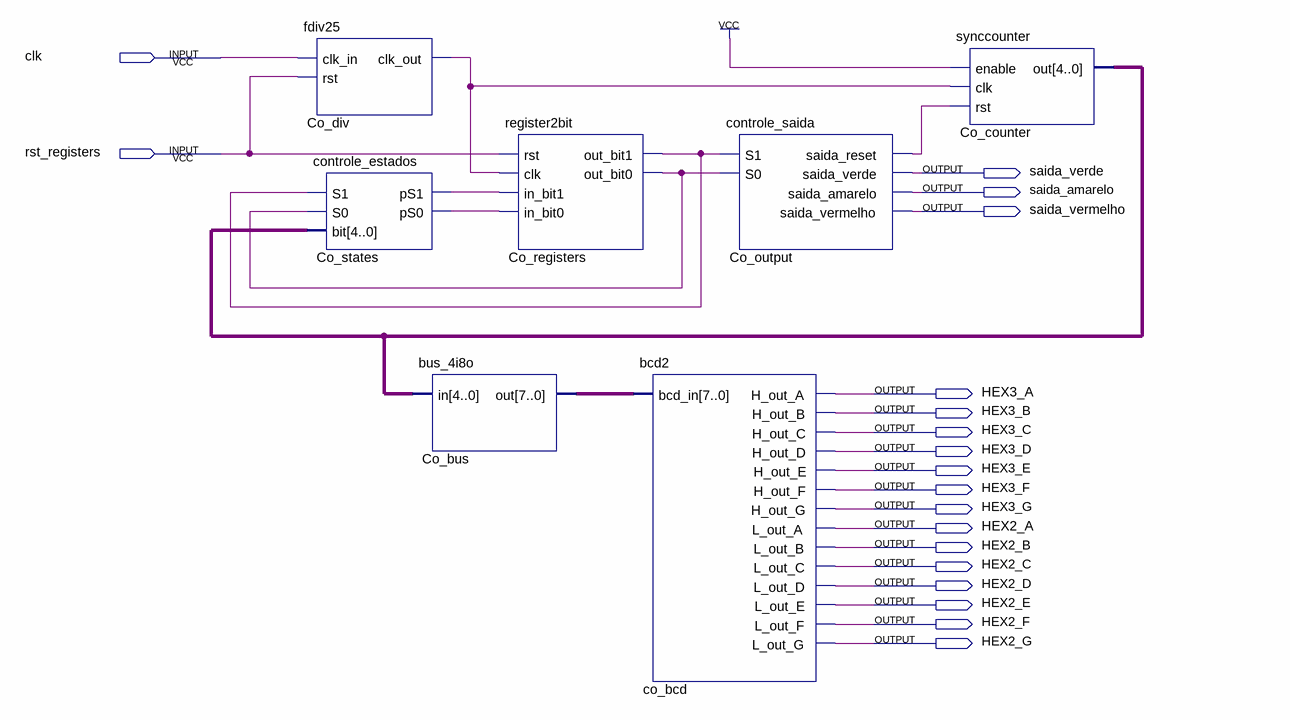
[diagram p0: schematic sheet]
// Quartus schematic lab08.bdf as structural Verilog: 7 symbols, 19 pins
module lab08 (
  input  clk,
  input  rst_registers,
  output saida_verde,
  output saida_amarelo,
  output saida_vermelho,
  output HEX3_A,
  output HEX3_B,
  output HEX3_C,
  output HEX3_D,
  output HEX3_E,
  output HEX3_F,
  output HEX3_G,
  output HEX2_A,
  output HEX2_B,
  output HEX2_C,
  output HEX2_D,
  output HEX2_E,
  output HEX2_F,
  output HEX2_G
);

  wire Co_div_clk_out, Co_output_saida_reset, Co_registers_out_bit0, Co_registers_out_bit1, Co_states_ps0,
       Co_states_ps1;
  wire [4:0] Co_counter_out;
  wire [7:0] Co_bus_out;

  fdiv25 Co_div (.clk_in(clk), .rst(rst_registers), .clk_out(Co_div_clk_out));
  controle_estados Co_states (
    .S1(Co_registers_out_bit1), .S0(Co_registers_out_bit0), .\bit (Co_counter_out), .pS1(Co_states_ps1),
    .pS0(Co_states_ps0));
  bus_4i8o Co_bus (.in(Co_counter_out), .out(Co_bus_out));
  register2bit Co_registers (
    .rst(rst_registers), .clk(Co_div_clk_out), .in_bit1(Co_states_ps1), .in_bit0(Co_states_ps0),
    .out_bit1(Co_registers_out_bit1), .out_bit0(Co_registers_out_bit0));
  bcd2 co_bcd (
    .bcd_in(Co_bus_out), .H_out_A(HEX3_A), .H_out_B(HEX3_B), .H_out_C(HEX3_C), .H_out_D(HEX3_D),
    .H_out_E(HEX3_E), .H_out_F(HEX3_F), .H_out_G(HEX3_G), .L_out_A(HEX2_A), .L_out_B(HEX2_B),
    .L_out_C(HEX2_C), .L_out_D(HEX2_D), .L_out_E(HEX2_E), .L_out_F(HEX2_F), .L_out_G(HEX2_G));
  controle_saida Co_output (
    .S1(Co_registers_out_bit1), .S0(Co_registers_out_bit0), .saida_reset(Co_output_saida_reset),
    .saida_verde(saida_verde), .saida_amarelo(saida_amarelo), .saida_vermelho(saida_vermelho));
  synccounter Co_counter (.enable(1'b1), .clk(Co_div_clk_out), .rst(Co_output_saida_reset), .out(Co_counter_out));
endmodule
